# Altium schematic sheet main.SchDoc
size A4; SheetNumber: 1; SheetTotal: 1
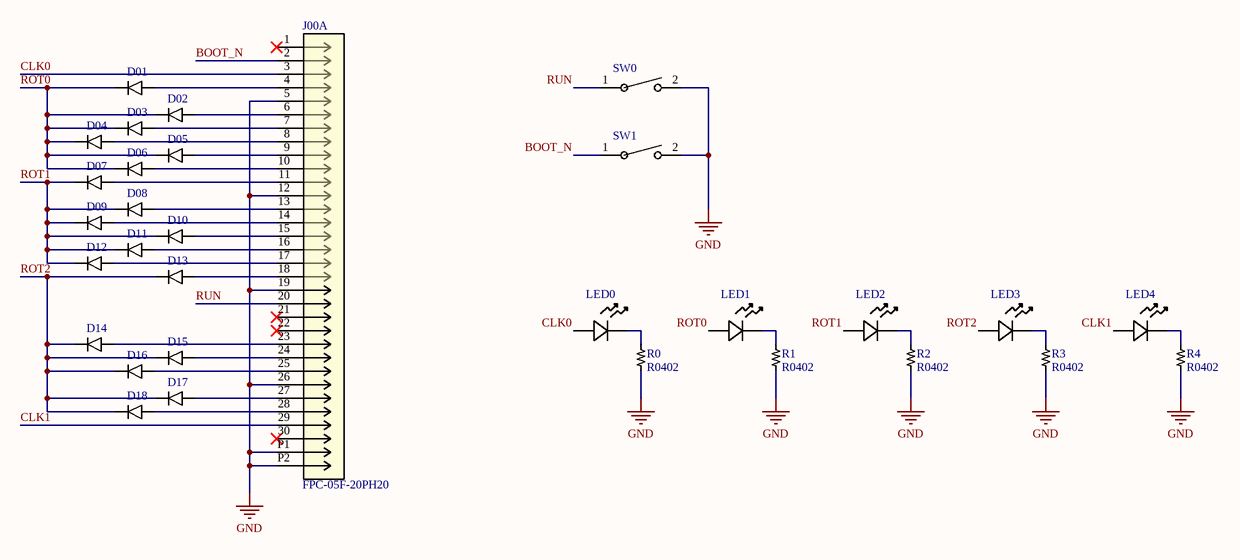
[diagram p0: main.SchDoc]

## Parts
D01  1N4148W  [SOD123_DIO]  (value not drawn)
D02  1N4148W  [SOD123_DIO]  (value not drawn)
D03  1N4148W  [SOD123_DIO]  (value not drawn)
D04  1N4148W  [SOD123_DIO]  (value not drawn)
D05  1N4148W  [SOD123_DIO]  (value not drawn)
D06  1N4148W  [SOD123_DIO]  (value not drawn)
D07  1N4148W  [SOD123_DIO]  (value not drawn)
D08  1N4148W  [SOD123_DIO]  (value not drawn)
D09  1N4148W  [SOD123_DIO]  (value not drawn)
D10  1N4148W  [SOD123_DIO]  (value not drawn)
D11  1N4148W  [SOD123_DIO]  (value not drawn)
D12  1N4148W  [SOD123_DIO]  (value not drawn)
D13  1N4148W  [SOD123_DIO]  (value not drawn)
D14  1N4148W  [SOD123_DIO]  (value not drawn)
D15  1N4148W  [SOD123_DIO]  (value not drawn)
D16  1N4148W  [SOD123_DIO]  (value not drawn)
D17  1N4148W  [SOD123_DIO]  (value not drawn)
D18  1N4148W  [SOD123_DIO]  (value not drawn)
J00A  FPC-05F-20PH20  [FPC-05F-30PH20]
LED0  XL-1608UWC-04  [LED_XL-1608_XLG]  (value not drawn)
LED1  XL-1608UWC-04  [LED_XL-1608_XLG]  (value not drawn)
LED2  XL-1608UWC-04  [LED_XL-1608_XLG]  (value not drawn)
LED3  XL-1608UWC-04  [LED_XL-1608_XLG]  (value not drawn)
LED4  XL-1608UWC-04  [LED_XL-1608_XLG]  (value not drawn)
R0  R0402  [RES0402_CPF_TYCO_TYC]
R1  R0402  [RES0402_CPF_TYCO_TYC]
R2  R0402  [RES0402_CPF_TYCO_TYC]
R3  R0402  [RES0402_CPF_TYCO_TYC]
R4  R0402  [RES0402_CPF_TYCO_TYC]
SW0  TS-1088-AR02016  [SW_TS-1088_XNP]  (value not drawn)
SW1  TS-1088-AR02016  [SW_TS-1088_XNP]  (value not drawn)

## Nets
GND: J00A.5 J00A.12 J00A.19 J00A.26 J00A.P1 J00A.P2 R0.2 R1.2 R2.2 R3.2 R4.2 SW0.2 SW1.2
BOOT_N: J00A.2 SW1.1
CLK0: J00A.3 LED0.2(ANODE)
CLK1: J00A.29 LED4.2(ANODE)
ROT0: D01.K D02.K D03.K D04.K D05.K D06.K LED1.2(ANODE)
ROT1: D07.K D08.K D09.K D10.K D11.K D12.K LED2.2(ANODE)
ROT2: D13.K D14.K D15.K D16.K D17.K D18.K LED3.2(ANODE)
RUN: J00A.20 SW0.1
NetD01_A: D01.A J00A.4
NetD02_A: D02.A J00A.6
NetD03_A: D03.A J00A.7
NetD04_A: D04.A J00A.8
NetD05_A: D05.A J00A.9
NetD06_A: D06.A J00A.10
NetD07_A: D07.A J00A.11
NetD08_A: D08.A J00A.13
NetD09_A: D09.A J00A.14
NetD10_A: D10.A J00A.15
NetD11_A: D11.A J00A.16
NetD12_A: D12.A J00A.17
NetD13_A: D13.A J00A.18
NetD14_A: D14.A J00A.23
NetD15_A: D15.A J00A.24
NetD16_A: D16.A J00A.25
NetD17_A: D17.A J00A.27
NetD18_A: D18.A J00A.28
NetLED0_1: LED0.1(CATHODE) R0.1
NetLED1_1: LED1.1(CATHODE) R1.1
NetLED2_1: LED2.1(CATHODE) R2.1
NetLED3_1: LED3.1(CATHODE) R3.1
NetLED4_1: LED4.1(CATHODE) R4.1

Not connected (* = marked no-connect by the designer): J00A 1* 21* 22* 30*

## Library data of the parts
D01 D02 D03 D04 D05 D06 D07 D08 D09-D18 = 1N4148W: Small Signal Diode
J00A = FPC-05F-30PH20: 30 Pin 0.5 Pitch FPC connector
LED0-LED4 = XL-1608UWC-04: No Description Available; Manufacturer_Name: XINGLIGHT; Copyright: Copyright (C) 2025 Ultra Librarian. All rights reserved.; Manufacturer_Part_Number: XL-1608UWC-04
R0-R4 = R0402: CPF 0402 RL; Manufacturer_Name: TE Connectivity; Manufacturer_Part_Number: CPF0402B33RE1; Copyright: Copyright (C) 2025 Ultra Librarian. All rights reserved.; Datasheet: https://www.te.com/commerce/DocumentDelivery/DDEController?Action=srchrtrv&DocNm=1773200&DocType=Data+Sheet&DocLang=English&PartCntxt=1-1879208-3&DocFormat=pdf
SW0 SW1 = TS-1088-AR02016: Description; Manufacturer_Name: Xunpu; Copyright: Copyright (C) 2026 Ultra Librarian. All rights reserved.; Manufacturer_Part_Number: TS-1088-AR02016